# Altium schematic sheet S04-SPEAKER.SchDoc
size B; SheetNumber: 5; SheetTotal: 5; BLOCK-TITLE: DAC AND SPEAKER OUTPUT DRIVER; BLOCK-SIZE: B; BLOCK-PROJECT: MULTIMOD AUDIO MODULE; BLOCK-REVISION: 1; BLOCK-ORGANIZATION: UNIVERSITY OF FLORIDA; BLOCK-DESIGNER: MEHRON TALEBI; BLOCK-IDENTIFIER: SUMMER 2023; BLOCK-REVIEWER: MIKE STAPLETON
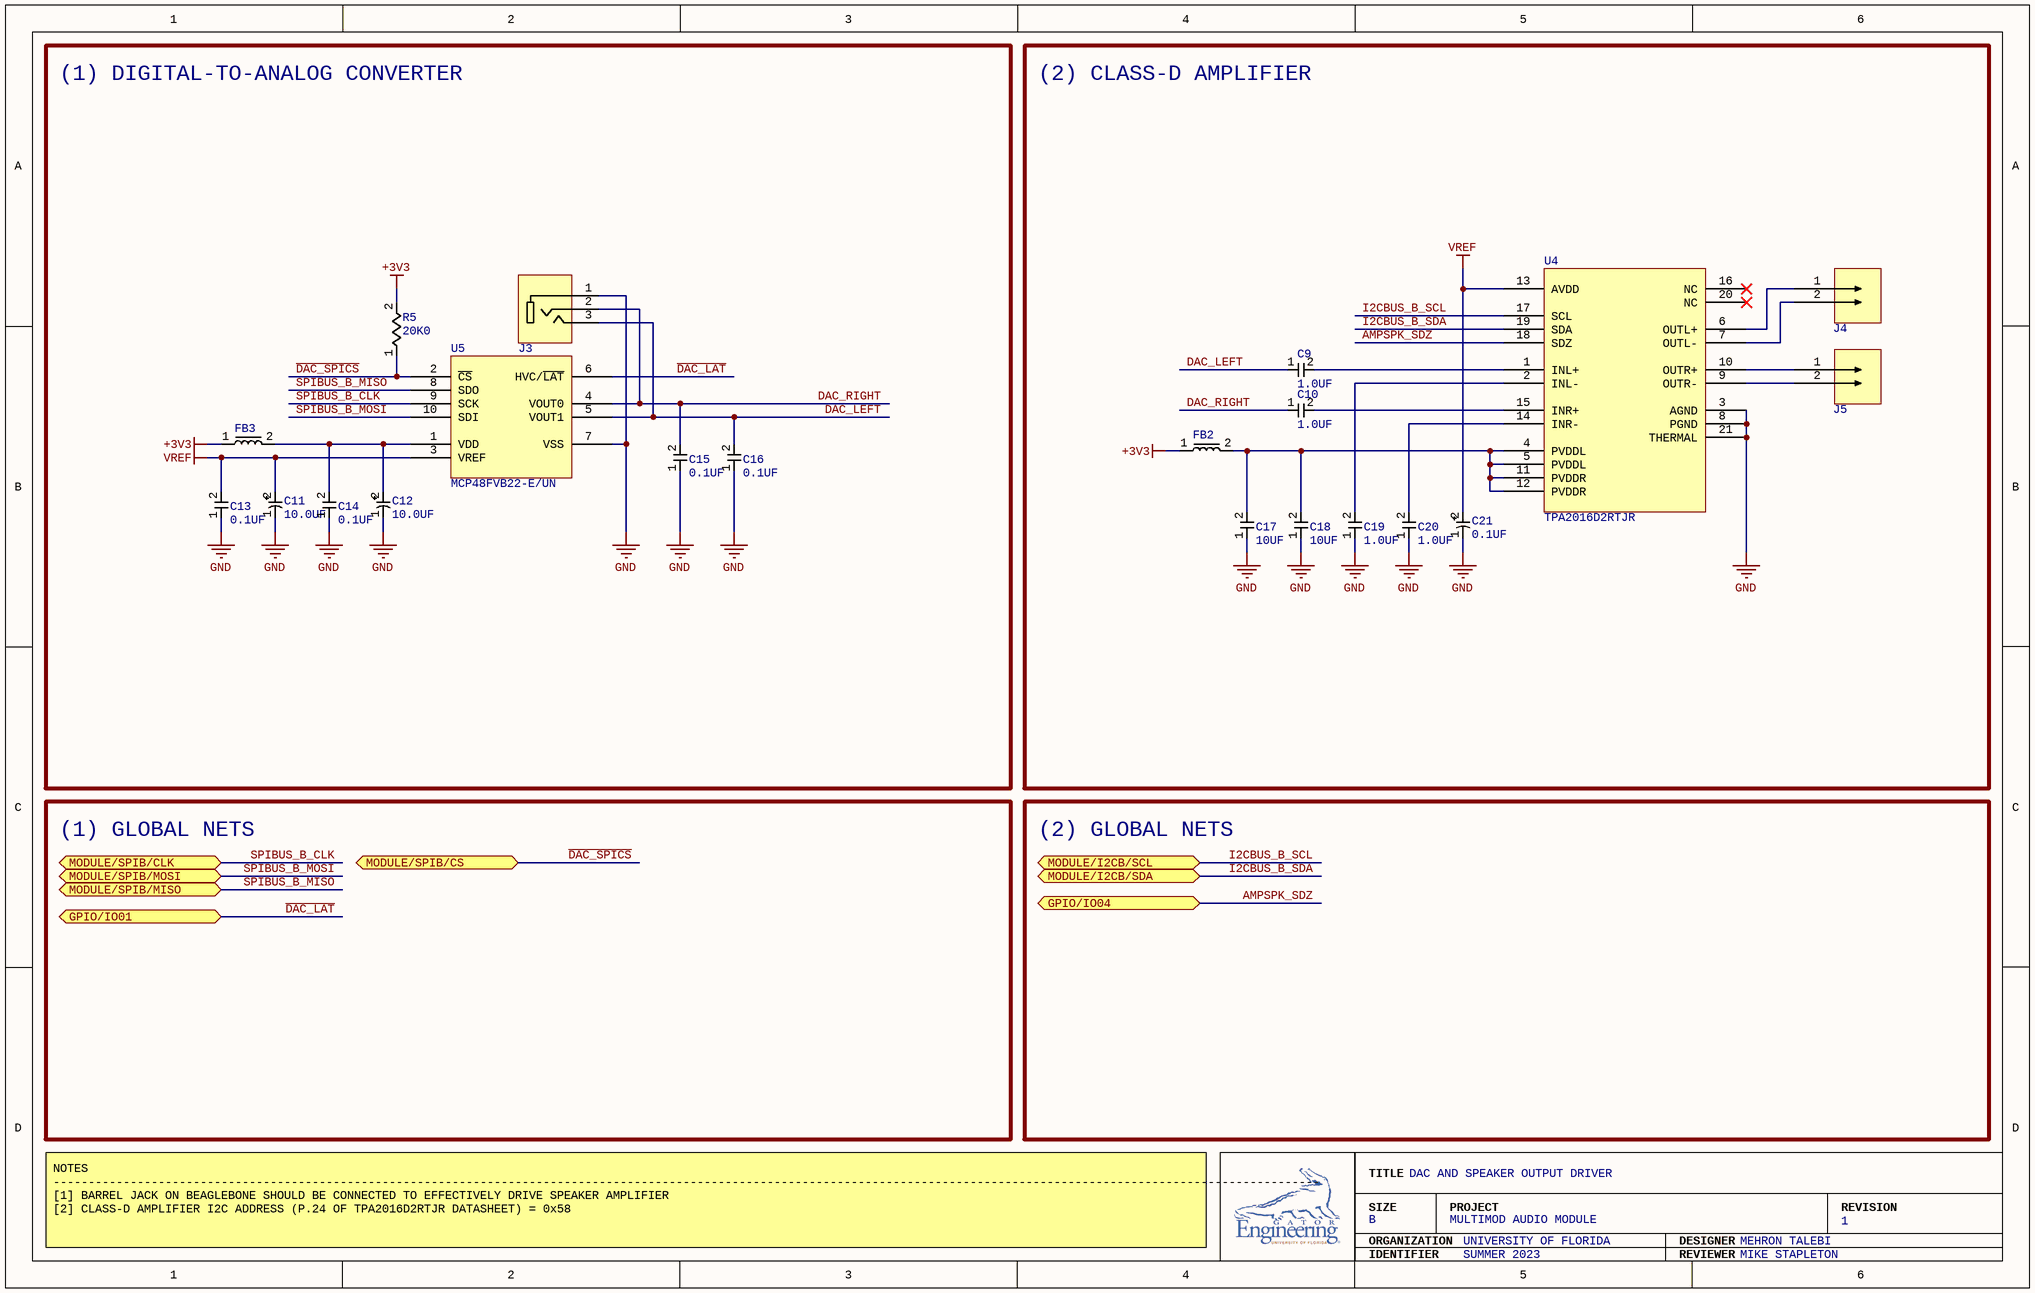
[diagram p0: S04-SPEAKER.SchDoc]

## Parts
C9  1.0UF  [CL21B105KAFNFNE]
C10  1.0UF  [CL21B105KAFNFNE]
C11  10.0UF  [TAJR106M006RNJ]
C12  10.0UF  [TAJR106M006RNJ]
C13  0.1UF  [CL21B104KACNNNC]
C14  0.1UF  [CL21B104KACNNNC]
C15  0.1UF  [CL21B104KACNNNC]
C16  0.1UF  [CL21B104KACNNNC]
C17  10UF  [CL21B106KPQNFNE]
C18  10UF  [CL21B106KPQNFNE]
C19  1.0UF  [CL21B105KAFNFNE]
C20  1.0UF  [CL21B105KAFNFNE]
C21  0.1UF  [TAJR104K035RNJ]
FB2  BLM21PG221SN1D  [BLM21PG221SN1D]  (value not drawn)
FB3  ILBB0805ER102V  [ILBB0805ER102V]  (value not drawn)
J3  SJ-3523-SMT-TR  [SJ-3523-SMT-TR]  (value not drawn)
J4  TB001-500-02BE  [TB001-500-02BE]  (value not drawn)
J5  TB001-500-02BE  [TB001-500-02BE]  (value not drawn)
R5  20K0  [RC0805FR-074K7L]
U4  TPA2016D2RTJR  [TPA2016D2RTJR]
U5  MCP48FVB22-E/UN  [MCP48FVB22-E/UN]

## Blocks framed on the sheet
(1) DIGITAL-TO-ANALOG CONVERTER: C11-C16 FB3 J3 R5 U5
(2) CLASS-D AMPLIFIER: C9 C10 C17-C21 FB2 J4 J5 U4

## Ports
GPIO/IO01 (bidir), GPIO/IO04 (bidir), MODULE/I2CB/SCL (bidir), MODULE/I2CB/SDA (bidir), MODULE/SPIB/CLK (bidir), MODULE/SPIB/CS (bidir), MODULE/SPIB/MISO (bidir), MODULE/SPIB/MOSI (bidir)

## Nets
+3V3: FB2.1 FB3.1 R5.2
GND: C11.1 C12.1 C13.1 C14.1 C15.1 C16.1 C17.1 C18.1 C19.1 C20.1 C21.1 J3.1 U4.3(AGND) U4.8(PGND) U4.21(THERMAL) U5.7(VSS)
VREF: C11.2 C13.2 C21.2 U4.13(AVDD) U5.3(VREF)
~{DAC_LAT}: U5.6(HVC/~{LAT}) ; port GPIO/IO01
~{DAC_SPICS}: R5.1 U5.2(~{CS}) ; port MODULE/SPIB/CS
AMPSPK_SDZ: U4.18(SDZ) ; port GPIO/IO04
DAC_LEFT: C9.1 C16.2 J3.3 U5.5(VOUT1)
DAC_RIGHT: C10.1 C15.2 J3.2 U5.4(VOUT0)
I2CBUS_B_SCL: U4.17(SCL) ; port MODULE/I2CB/SCL
I2CBUS_B_SDA: U4.19(SDA) ; port MODULE/I2CB/SDA
SPIBUS_B_CLK: U5.9(SCK) ; port MODULE/SPIB/CLK
SPIBUS_B_MISO: U5.8(SDO) ; port MODULE/SPIB/MISO
SPIBUS_B_MOSI: U5.10(SDI) ; port MODULE/SPIB/MOSI
NetC9_2: C9.2 U4.1(INL+)
NetC10_2: C10.2 U4.15(INR+)
NetC12_2: C12.2 C14.2 FB3.2 U5.1(VDD)
NetC17_2: C17.2 C18.2 FB2.2 U4.4(PVDDL) U4.5(PVDDL) U4.11(PVDDR) U4.12(PVDDR)
NetC19_2: C19.2 U4.2(INL-)
NetC20_2: C20.2 U4.14(INR-)
NetJ4_1: J4.1 U4.6(OUTL+)
NetJ4_2: J4.2 U4.7(OUTL-)
NetJ5_1: J5.1 U4.10(OUTR+)
NetJ5_2: J5.2 U4.9(OUTR-)

Not connected (* = marked no-connect by the designer): U4 16(NC)* 20(NC)*

## Notes on the sheet
- (1) GLOBAL NETS
- (2) GLOBAL NETS
- NOTES
  -------------------------------------------------------------------------------------------------------------------------------------------------------------------------------------
  [1] BARREL JACK ON BEAGLEBONE SHOULD BE CONNECTED TO EFFECTIVELY DRIVE SPEAKER AMPLIFIER
  [2] CLASS-D AMPLIFIER I2C ADDRESS (P.24 OF TPA2016D2RTJR DATASHEET) = 0x58
- TITLE
- SIZE
- ORGANIZATION
- PROJECT
- DESIGNER
- REVISION
- IDENTIFIER
- REVIEWER

## Library data of the parts
C9 C10 C19 C20 = CL21B105KAFNFNE: CAP CER 1UF 25V X7R 0805; Capacitance: 1 µF; Tolerance: ±10%; Voltage - Rated: 25V; Temperature Coefficient: X7R; Operating Temperature: -55°C ~ 125°C; Applications: General Purpose; Mounting Type: Surface Mount, MLCC; Package / Case: 0805 (2012 Metric); Size / Dimension: 0.079" L x 0.049" W (2.00mm x 1.25mm); Thickness (Max): 0.053" (1.35mm); Supplier 1: Arrow Electronics; Supplier Part Number 1: CL21B105KAFNFNE
C11 C12 = TAJR106M006RNJ: CAP TANT 10UF 20% 6.3V 0805; Manufacturer Size Code: R; Capacitance: 10 µF; Type: Molded; ESR (Equivalent Series Resistance): 6Ohm; Tolerance: ±20%; Voltage - Rated: 6.3 V; Operating Temperature: -55°C ~ 125°C; Mounting Type: Surface Mount; Package / Case: 0805 (2012 Metric); Size / Dimension: 0.081" L x 0.051" W (2.05mm x 1.30mm); Height - Seated (Max): 0.047" (1.20mm); Features: General Purpose; Supplier 1: Arrow Electronics; Supplier Part Number 1: TAJR106M006RNJ
C13-C16 = CL21B104KACNNNC: CAP CER 0.1UF 25V X7R 0805; Capacitance: 0.1 µF; Tolerance: ±10%; ComponentLink1Description: Datasheet; ComponentLink1URL: https://media.digikey.com/pdf/Data%20Sheets/Samsung%20PDFs/CL21B105KAFNNNE_Spec.pdf; Voltage - Rated: 25V; Temperature Coefficient: X7R; Operating Temperature: -55°C ~ 125°C; Applications: General Purpose; Mounting Type: Surface Mount, MLCC; Package / Case: 0805 (2012 Metric); Size / Dimension: 0.079" L x 0.049" W (2.00mm x 1.25mm); Thickness (Max): 0.037" (0.95mm); Supplier 1: Arrow Electronics; Supplier Part Number 1: CL21B104KACNNNC
C17 C18 = CL21B106KPQNFNE: CAP CER 10UF 10V X7R 0805; Capacitance: 10 µF; Tolerance: ±10%; Voltage - Rated: 10V; Temperature Coefficient: X7R; Operating Temperature: -55°C ~ 125°C; Applications: General Purpose; Mounting Type: Surface Mount, MLCC; Package / Case: 0805 (2012 Metric); Size / Dimension: 0.079" L x 0.049" W (2.00mm x 1.25mm); Thickness (Max): 0.053" (1.35mm); Supplier 1: Arrow Electronics; Supplier Part Number 1: CL21B106KPQNFNE
C21 = TAJR104K035RNJ: CAP TANT 0.1UF 10% 35V 0805; Manufacturer Size Code: R; Capacitance: 0.1 µF; Type: Molded; ESR (Equivalent Series Resistance): 29Ohm; Tolerance: ±10%; Voltage - Rated: 35 V; Operating Temperature: -55°C ~ 125°C; Mounting Type: Surface Mount; Package / Case: 0805 (2012 Metric); Size / Dimension: 0.081" L x 0.051" W (2.05mm x 1.30mm); Height - Seated (Max): 0.047" (1.20mm); Features: General Purpose; Supplier 1: Digi-Key; Supplier Part Number 1: 478-8926-1-ND
FB2 = BLM21PG221SN1D: FERRITE BEAD 220 OHM 0805 1LN; Filter Type: Power Line; Number of Lines: 1; Impedance @ Frequency: 220 Ohms @ 100 MHz; Current Rating (Max): 2A; DC Resistance (DCR) (Max): 45mOhm; Operating Temperature: -55°C ~ 125°C; Package / Case: 0805 (2012 Metric); Mounting Type: Surface Mount; Height (Max): 0.041" (1.05mm); Size / Dimension: 0.079" L x 0.049" W (2.00mm x 1.25mm); Supplier 1: Arrow Electronics; Supplier Part Number 1: BLM21PG221SN1D
FB3 = ILBB0805ER102V: FERRITE BEAD 1K OHM 0805 1LN; Number of Lines: 1; Impedance @ Frequency: 1 kOhms @ 100 MHz; Current Rating (Max): 100mA; DC Resistance (DCR) (Max): 350mOhm; Operating Temperature: -55°C ~ 125°C; Package / Case: 0805 (2012 Metric); Mounting Type: Surface Mount; Height (Max): 0.043" (1.10mm); Size / Dimension: 0.079" L x 0.049" W (2.00mm x 1.25mm); Supplier 1: Digi-Key; Supplier Part Number 1: 541-2293-1-ND
J3 = SJ-3523-SMT-TR: CONN JACK STEREO 3.5MM SMD R/A; Connector Type: Phone Jack; Gender: Female; Signal Lines: Stereo (3 Conductor, TRS); Industry Recognized Mating Diameter: 3.50mm (0.141", 1/8", Mini Plug) - Headphone; Actual Diameter: 0.142" (3.60mm); Number of Positions/Contacts: 3 Conductors, 3 Contacts; Internal Switch(s): Does Not Contain Switch; Shielding: Unshielded; Voltage - Rated: 12VDC; Current Rating (Amps): 1 A; Mating Length/Depth: 0.551" (14.00mm); Body Color: Black; Mounting Type: Surface Mount, Right Angle; Termination: Solder; Features: Board Guide; Operating Temperature: -25°C ~ 85°C; Contact Material - Plating: Silver; Housing Material: Polyamide (PA6T), Nylon 6T; Contact Material: Brass, Copper Alloy; Supplier 1: Digi-Key; Supplier Part Number 1: CP-3523SJCT-ND
J4 J5 = TB001-500-02BE: TERMINAL BLOCK, SCREW TYPE, 5.00; Number of Levels: 1; Positions Per Level: 2; Pitch: 0.197" (5.00mm); Mating Orientation: Horizontal with Board; Current: 15 A; Voltage: 300 V; Wire Gauge: 12-22 AWG; Wire Termination: Screw - Leaf Spring, Wire Guard; Clamp Material - Plating: Steel, Stainless; Screw Material - Plating: Steel - Zinc Plated; Torque - Screw: 0.5 Nm (4.4 Lb-In); Screw Thread: M3; Mounting Type: Through Hole; Features: Interlocking (Side); Color: Blue; Operating Temperature: -40°C ~ 105°C; Housing Material: Polybutylene Terephthalate (PBT); Contact Material - Plating: Copper Alloy - Tin Plated; Supplier 1: Digi-Key; Supplier Part Number 1: 102-6134-ND
R5 = RC0805FR-0720KL: RES 20K OHM 1% 1/8W 0805; Resistance: 20 kOhms; Power (Watts): 0.125W, 1/8W; Temperature Coefficient: ±100ppm/°C; Tolerance: ±1%; Composition: Thick Film; Features: Moisture Resistant; Operating Temperature: -55°C ~ 155°C; Package / Case: 0805 (2012 Metric); Size / Dimension: 0.079" L x 0.049" W (2.00mm x 1.25mm); Height - Seated (Max): 0.024" (0.60mm); Number of Terminations: 2; Supplier 1: Digi-Key; Supplier Part Number 1: 311-20.0KCRCT-ND
U4 = TPA2016D2RTJR: IC AMP CLASS D STEREO 2.8W 20QFN; Output Type: 2-Channel (Stereo); Max Output Power x Channels @ Load: 2.8W x 2 @ 4Ohm; Voltage - Supply: 2.5V ~ 5.5V; Type: Class D; Features: Differential Inputs, I²C, Short-Circuit and Thermal Protection, Shutdown, Volume Control; Mounting Type: Surface Mount; Operating Temperature: -40°C ~ 85°C (TA); Supplier Device Package: 20-QFN (4x4); Package / Case: 20-WFQFN Exposed Pad; Supplier 1: Digi-Key; Supplier Part Number 1: 296-25430-1-ND
U5 = MCP48FVB22-E/UN: IC DAC 12BIT V-OUT 10MSOP; Number of Bits: 12; Number of D/A Converters: 2; Settling Time: 7.8µs (Typ); Output Type: Voltage - Buffered; Differential Output: No; Data Interface: SPI; Reference Type: External, Internal; Voltage - Supply, Analog: 2.7V ~ 5.5V; INL/DNL (LSB): ±1.5, ±0.2; Architecture: R-2R; Voltage - Supply, Digital: 2.7V ~ 5.5V; Operating Temperature: -40°C ~ 125°C; Package / Case: 10-TFSOP, 10-MSOP (0.118", 3.00mm Width); Supplier Device Package: 10-MSOP; Mounting Type: Surface Mount; Supplier 1: Digi-Key; Supplier Part Number 1: MCP48FVB22-E/UN-ND